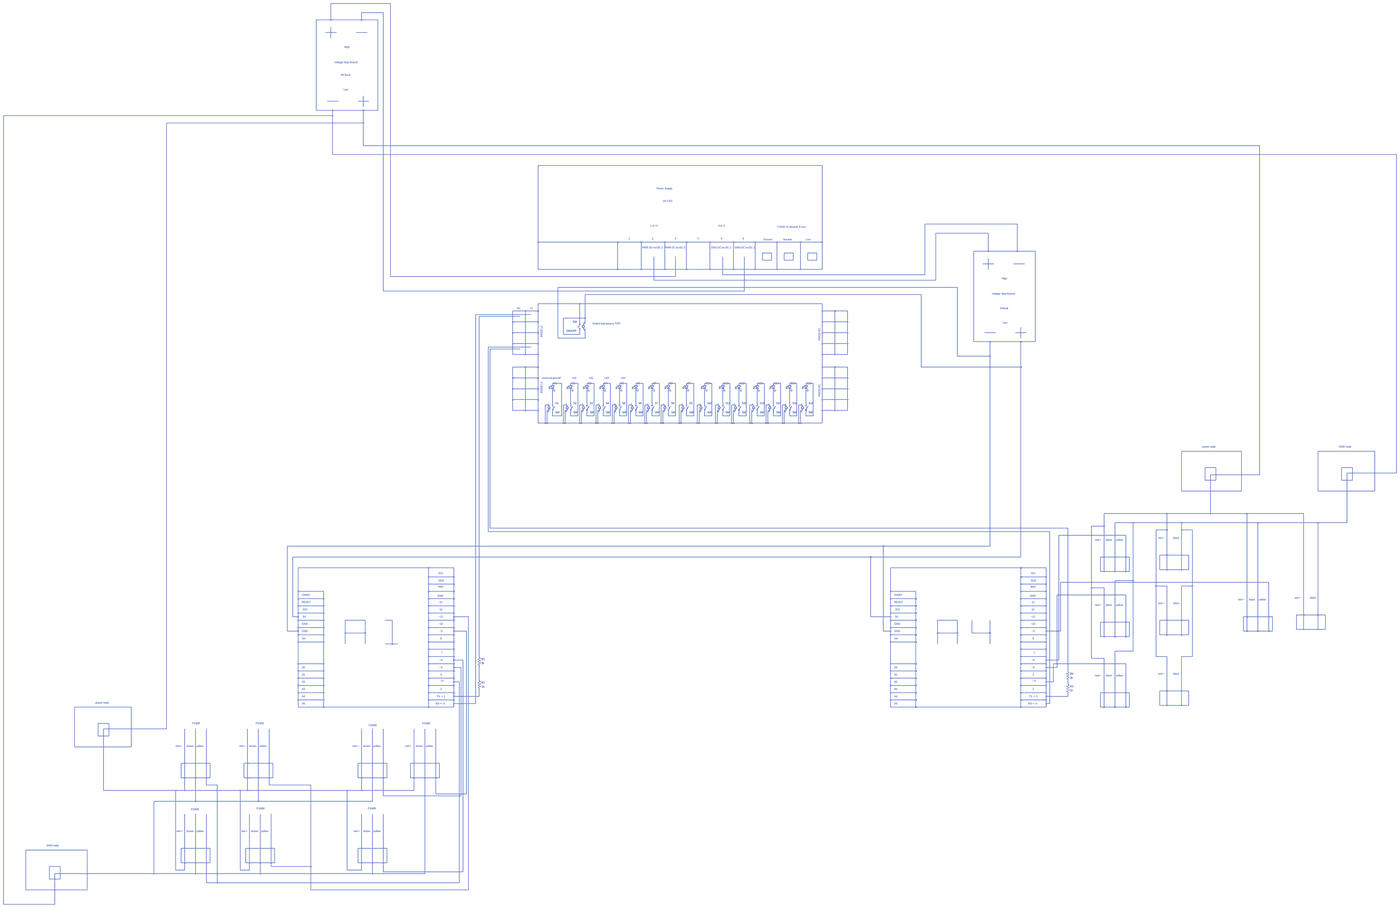
[diagram p0: schematic FDR Schematic.asc, whole sheet]
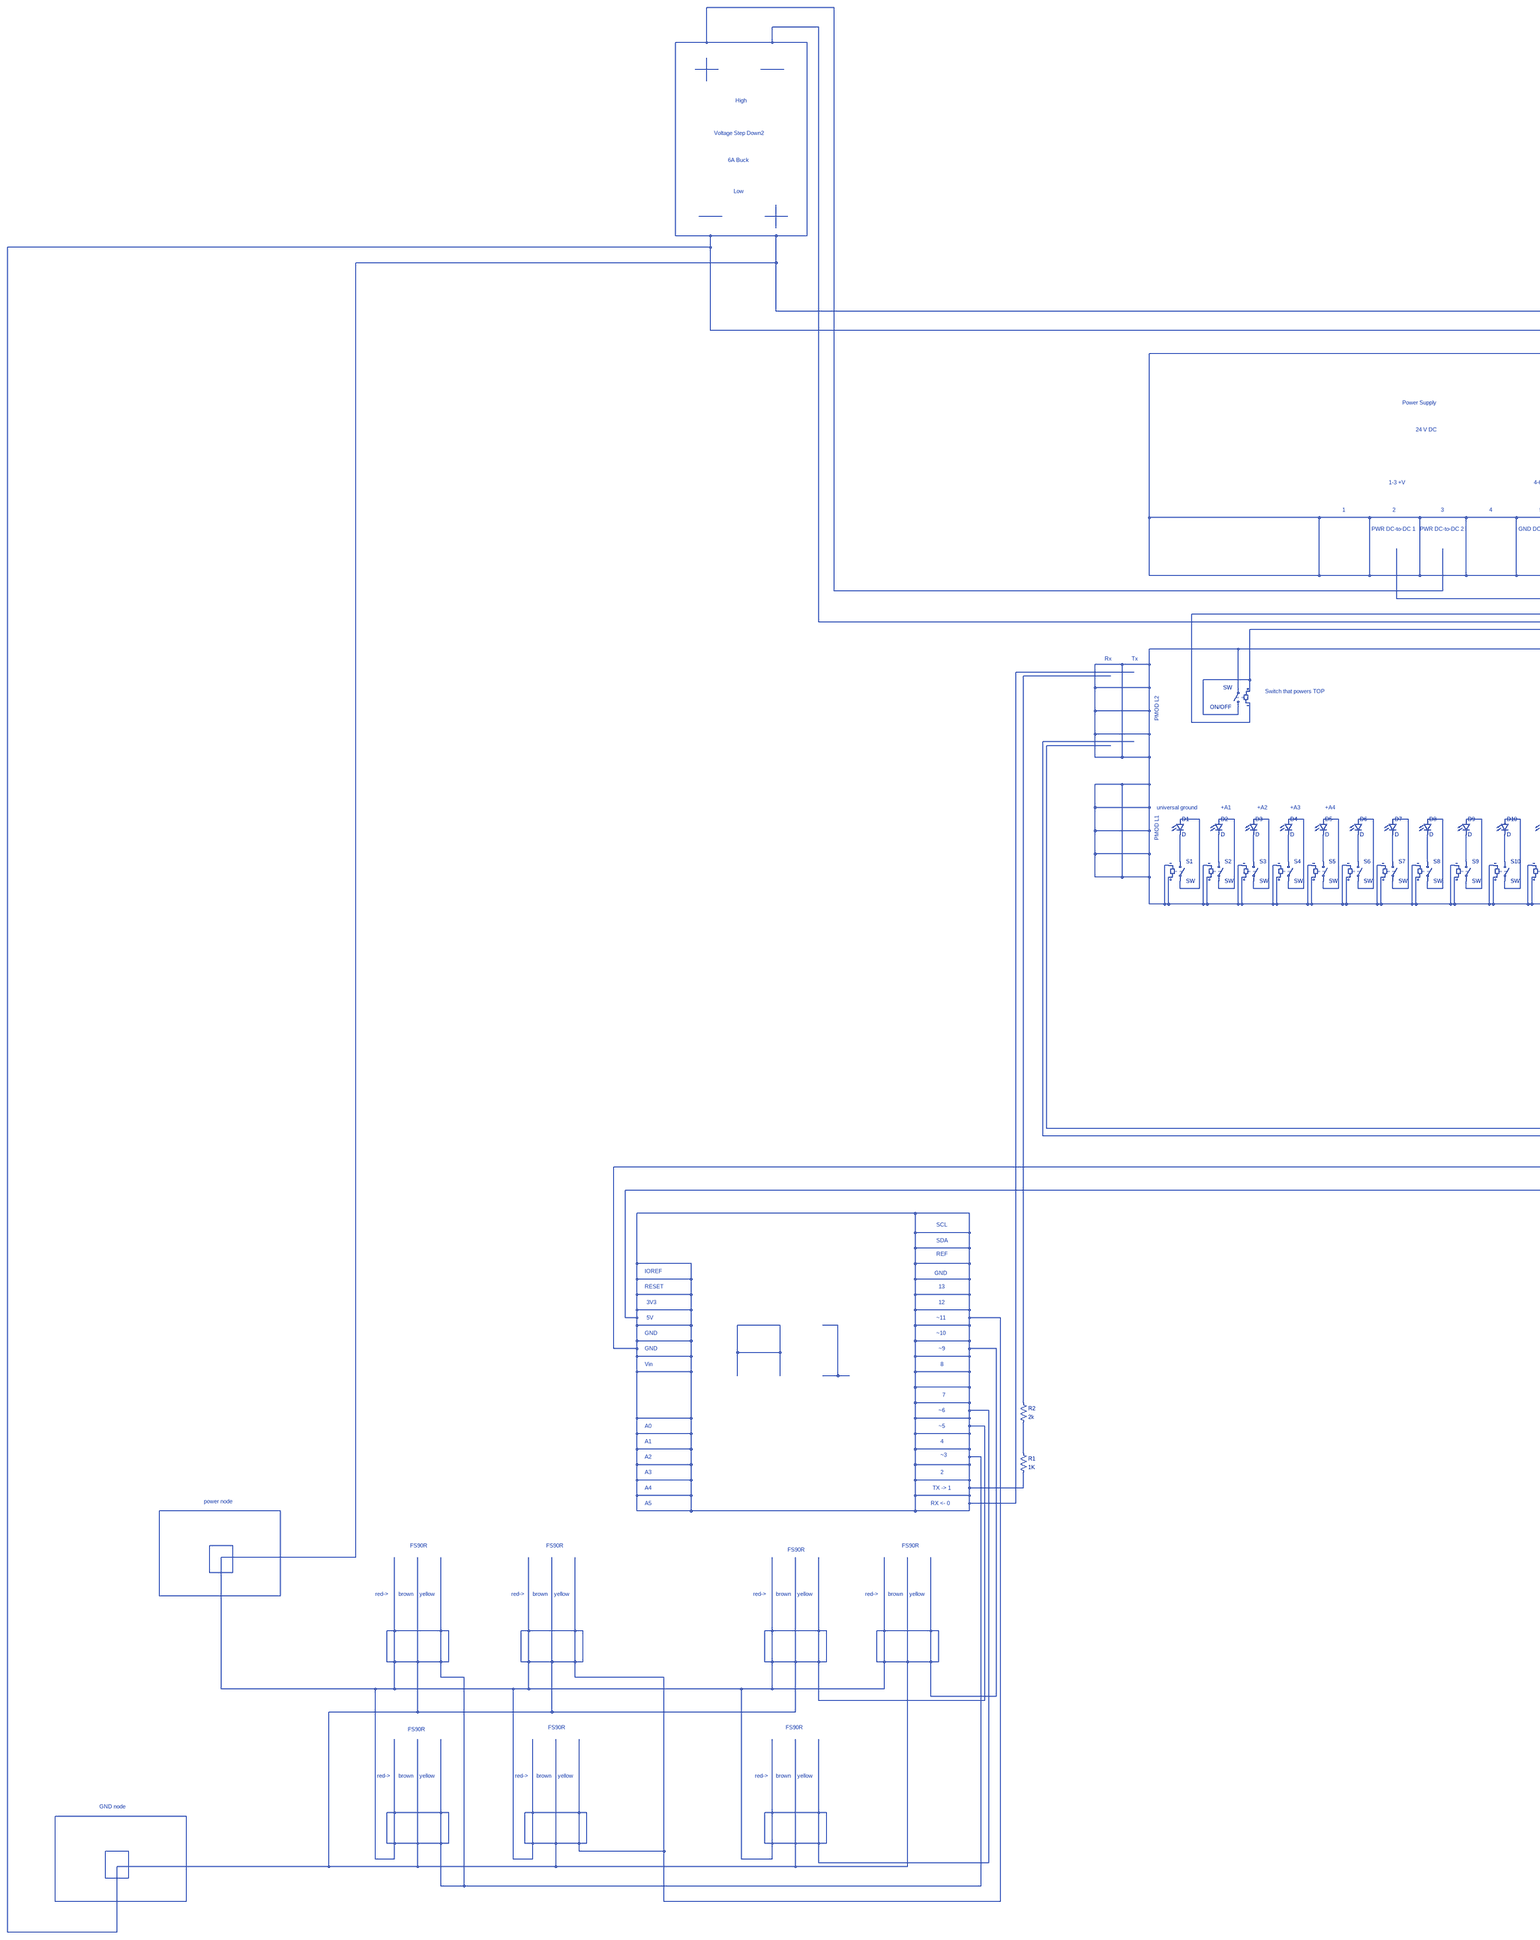
[diagram p1: schematic FDR Schematic.asc, part, row 1 of 1, column 1 of 2]
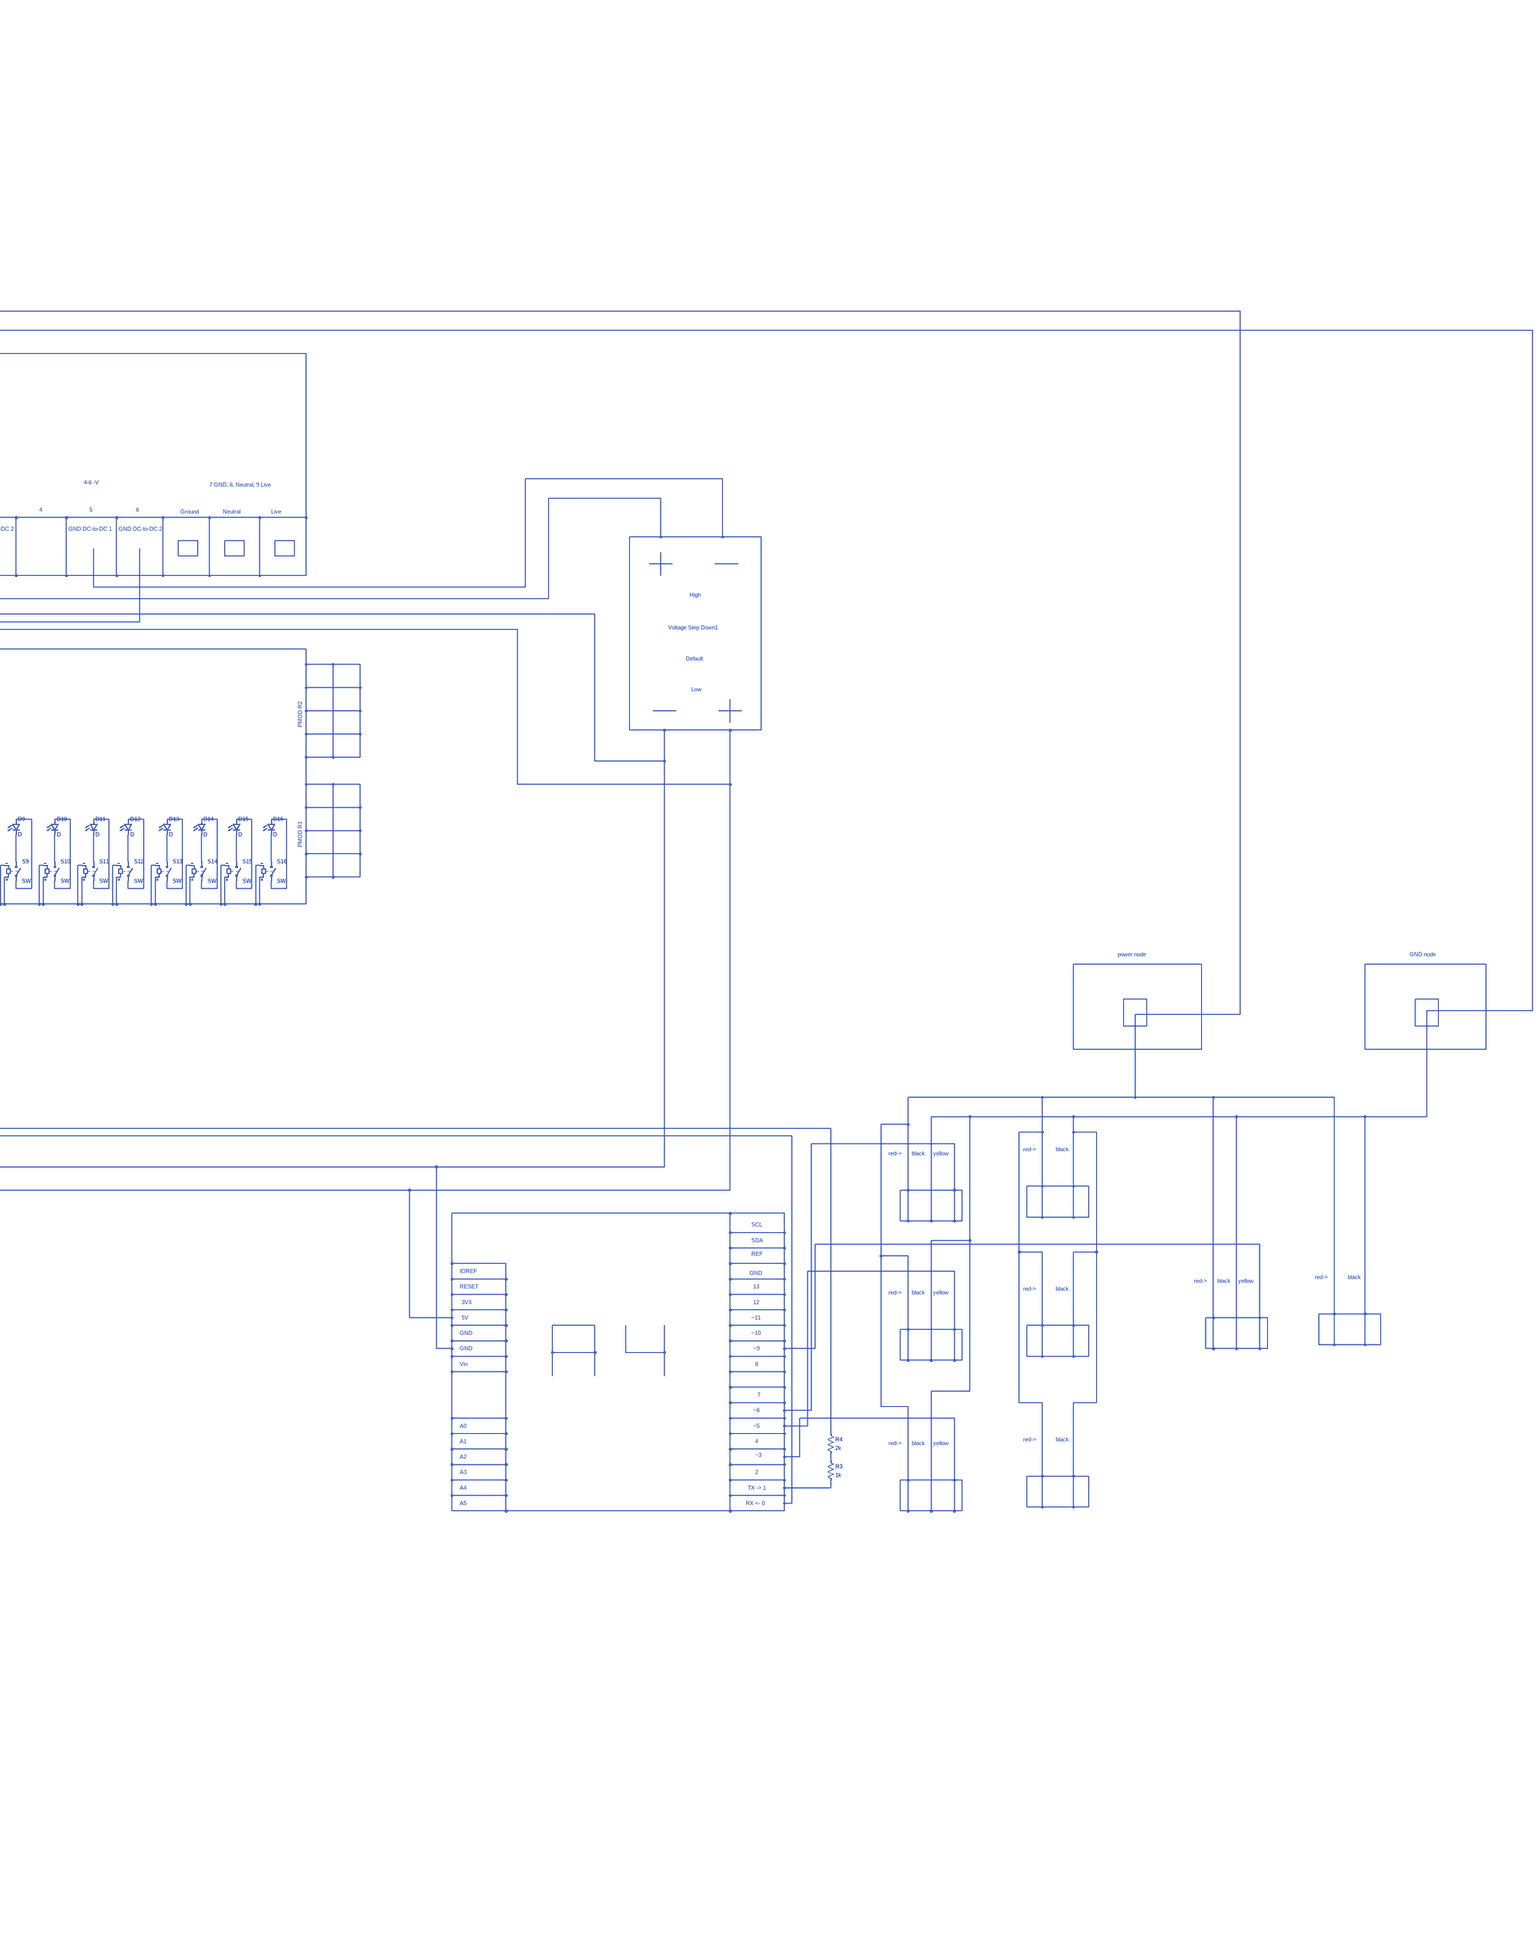
[diagram p2: schematic FDR Schematic.asc, part, row 1 of 1, column 2 of 2]
FDR Schematic.asc, the LTspice schematic file:
Version 4
SHEET 1 10276 11364
WIRE -1760 -7360 -2288 -7360
WIRE -1824 -7280 -2016 -7280
WIRE -2288 -7216 -2288 -7360
WIRE -2288 -7216 -2416 -7216
WIRE -2016 -7216 -2016 -7280
WIRE -2016 -7216 -2288 -7216
WIRE -1872 -7216 -2016 -7216
WIRE -2240 -7104 -2336 -7104
WIRE -1968 -7104 -2064 -7104
WIRE -2288 -7056 -2288 -7152
WIRE -2224 -6496 -2320 -6496
WIRE -1952 -6496 -2048 -6496
WIRE -2000 -6448 -2000 -6544
WIRE -2416 -6416 -2416 -7216
WIRE -2272 -6416 -2416 -6416
WIRE -2000 -6416 -2272 -6416
WIRE -1872 -6416 -1872 -7216
WIRE -1872 -6416 -2000 -6416
WIRE -2272 -6368 -2272 -6416
WIRE -2272 -6368 -5504 -6368
WIRE -2000 -6304 -2000 -6416
WIRE -2000 -6304 -3808 -6304
WIRE -2000 -5648 -2000 -6304
WIRE 6976 -5648 -2000 -5648
WIRE -2272 -5568 -2272 -6368
WIRE 8368 -5568 -2272 -5568
WIRE 2528 -5472 16 -5472
WIRE 4736 -4640 3920 -4640
WIRE 4480 -4560 4016 -4560
WIRE 16 -4480 16 -5472
WIRE 720 -4480 16 -4480
WIRE 928 -4480 720 -4480
WIRE 1136 -4480 928 -4480
WIRE 1328 -4480 1136 -4480
WIRE 1536 -4480 1328 -4480
WIRE 1744 -4480 1536 -4480
WIRE 1936 -4480 1744 -4480
WIRE 2128 -4480 1936 -4480
WIRE 2336 -4480 2128 -4480
WIRE 2528 -4480 2528 -5472
WIRE 2528 -4480 2336 -4480
WIRE 4480 -4400 4480 -4560
WIRE 4480 -4400 4352 -4400
WIRE 4736 -4400 4736 -4640
WIRE 4736 -4400 4480 -4400
WIRE 4896 -4400 4736 -4400
WIRE 2080 -4384 2000 -4384
WIRE 2272 -4384 2192 -4384
WIRE 2480 -4384 2400 -4384
WIRE 2000 -4320 2000 -4384
WIRE 2080 -4320 2080 -4384
WIRE 2080 -4320 2000 -4320
WIRE 2192 -4320 2192 -4384
WIRE 2272 -4320 2272 -4384
WIRE 2272 -4320 2192 -4320
WIRE 2400 -4320 2400 -4384
WIRE 2480 -4320 2480 -4384
WIRE 2480 -4320 2400 -4320
WIRE 4528 -4288 4432 -4288
WIRE 4800 -4288 4704 -4288
WIRE 16 -4240 16 -4480
WIRE 720 -4240 720 -4480
WIRE 720 -4240 16 -4240
WIRE 928 -4240 928 -4480
WIRE 928 -4240 720 -4240
WIRE 1136 -4240 1136 -4480
WIRE 1136 -4240 928 -4240
WIRE 1328 -4240 1328 -4480
WIRE 1328 -4240 1136 -4240
WIRE 1536 -4240 1536 -4480
WIRE 1536 -4240 1328 -4240
WIRE 1744 -4240 1744 -4480
WIRE 1744 -4240 1536 -4240
WIRE 1936 -4240 1936 -4480
WIRE 1936 -4240 1744 -4240
WIRE 2128 -4240 2128 -4480
WIRE 2128 -4240 1936 -4240
WIRE 2336 -4240 2336 -4480
WIRE 2336 -4240 2128 -4240
WIRE 2528 -4240 2528 -4480
WIRE 2528 -4240 2336 -4240
WIRE 4480 -4240 4480 -4336
WIRE 1648 -4192 1648 -4352
WIRE 3920 -4192 3920 -4640
WIRE 3920 -4192 1648 -4192
WIRE -1760 -4176 -1760 -7360
WIRE 1232 -4176 1232 -4352
WIRE 1232 -4176 -1760 -4176
WIRE 1040 -4144 1040 -4352
WIRE 4016 -4144 4016 -4560
WIRE 4016 -4144 1040 -4144
WIRE 4208 -4080 192 -4080
WIRE -1824 -4048 -1824 -7280
WIRE 1840 -4048 1840 -4352
WIRE 1840 -4048 -1824 -4048
WIRE 3888 -4016 432 -4016
WIRE 384 -3936 16 -3936
WIRE 2528 -3936 384 -3936
WIRE -96 -3872 -208 -3872
WIRE 16 -3872 16 -3936
WIRE 16 -3872 -96 -3872
WIRE 2528 -3872 2528 -3936
WIRE 2640 -3872 2528 -3872
WIRE 2752 -3872 2640 -3872
WIRE -48 -3840 -1008 -3840
WIRE -144 -3824 -976 -3824
WIRE 432 -3808 432 -4016
WIRE 432 -3808 240 -3808
WIRE -208 -3776 -208 -3872
WIRE 16 -3776 16 -3872
WIRE 16 -3776 -208 -3776
WIRE 384 -3776 384 -3936
WIRE 2528 -3776 2528 -3872
WIRE 2752 -3776 2752 -3872
WIRE 2752 -3776 2528 -3776
WIRE 432 -3760 432 -3808
WIRE -208 -3680 -208 -3776
WIRE 16 -3680 16 -3776
WIRE 16 -3680 -208 -3680
WIRE 2528 -3680 2528 -3776
WIRE 2752 -3680 2752 -3776
WIRE 2752 -3680 2528 -3680
WIRE 4544 -3680 4448 -3680
WIRE 4816 -3680 4720 -3680
WIRE 240 -3664 240 -3808
WIRE 384 -3664 384 -3696
WIRE 384 -3664 240 -3664
WIRE 192 -3632 192 -4080
WIRE 432 -3632 432 -3712
WIRE 432 -3632 192 -3632
WIRE 4768 -3632 4768 -3728
WIRE 4352 -3600 4352 -4400
WIRE 4496 -3600 4352 -3600
WIRE 4768 -3600 4496 -3600
WIRE 4896 -3600 4896 -4400
WIRE 4896 -3600 4768 -3600
WIRE -208 -3584 -208 -3680
WIRE 16 -3584 16 -3680
WIRE 16 -3584 -208 -3584
WIRE 2528 -3584 2528 -3680
WIRE 2752 -3584 2752 -3680
WIRE 2752 -3584 2528 -3584
WIRE -48 -3552 -896 -3552
WIRE -144 -3536 -880 -3536
WIRE -208 -3488 -208 -3584
WIRE -96 -3488 -96 -3872
WIRE -96 -3488 -208 -3488
WIRE 16 -3488 16 -3584
WIRE 16 -3488 -96 -3488
WIRE 2528 -3488 2528 -3584
WIRE 2640 -3488 2640 -3872
WIRE 2640 -3488 2528 -3488
WIRE 2752 -3488 2752 -3584
WIRE 2752 -3488 2640 -3488
WIRE 4208 -3472 4208 -4080
WIRE 4496 -3472 4496 -3600
WIRE 4496 -3472 4208 -3472
WIRE -96 -3376 -208 -3376
WIRE 16 -3376 16 -3488
WIRE 16 -3376 -96 -3376
WIRE 2528 -3376 2528 -3488
WIRE 2640 -3376 2528 -3376
WIRE 2752 -3376 2640 -3376
WIRE 3888 -3376 3888 -4016
WIRE 4768 -3376 4768 -3600
WIRE 4768 -3376 3888 -3376
WIRE -208 -3280 -208 -3376
WIRE 16 -3280 16 -3376
WIRE 16 -3280 -208 -3280
WIRE 2528 -3280 2528 -3376
WIRE 2752 -3280 2752 -3376
WIRE 2752 -3280 2528 -3280
WIRE 224 -3232 144 -3232
WIRE 368 -3232 304 -3232
WIRE 512 -3232 448 -3232
WIRE 656 -3232 592 -3232
WIRE 800 -3232 736 -3232
WIRE 944 -3232 880 -3232
WIRE 1088 -3232 1024 -3232
WIRE 1232 -3232 1168 -3232
WIRE 1392 -3232 1328 -3232
WIRE 1552 -3232 1488 -3232
WIRE 1712 -3232 1648 -3232
WIRE 1856 -3232 1792 -3232
WIRE 2016 -3232 1952 -3232
WIRE 2160 -3232 2096 -3232
WIRE 2304 -3232 2240 -3232
WIRE 2448 -3232 2384 -3232
WIRE -208 -3184 -208 -3280
WIRE 16 -3184 16 -3280
WIRE 16 -3184 -208 -3184
WIRE 2528 -3184 2528 -3280
WIRE 2752 -3184 2752 -3280
WIRE 2752 -3184 2528 -3184
WIRE -208 -3088 -208 -3184
WIRE 16 -3088 16 -3184
WIRE 16 -3088 -208 -3088
WIRE 2528 -3088 2528 -3184
WIRE 2752 -3088 2752 -3184
WIRE 2752 -3088 2528 -3088
WIRE 144 -3056 144 -3168
WIRE 304 -3056 304 -3168
WIRE 448 -3056 448 -3168
WIRE 592 -3056 592 -3168
WIRE 736 -3056 736 -3168
WIRE 880 -3056 880 -3168
WIRE 1024 -3056 1024 -3168
WIRE 1168 -3056 1168 -3168
WIRE 1328 -3056 1328 -3168
WIRE 1488 -3056 1488 -3168
WIRE 1648 -3056 1648 -3168
WIRE 1792 -3056 1792 -3168
WIRE 1952 -3056 1952 -3168
WIRE 2096 -3056 2096 -3168
WIRE 2240 -3056 2240 -3168
WIRE 2384 -3056 2384 -3168
WIRE 96 -3040 80 -3040
WIRE 256 -3040 240 -3040
WIRE 400 -3040 384 -3040
WIRE 544 -3040 528 -3040
WIRE 688 -3040 672 -3040
WIRE 832 -3040 816 -3040
WIRE 976 -3040 960 -3040
WIRE 1120 -3040 1104 -3040
WIRE 1280 -3040 1264 -3040
WIRE 1440 -3040 1424 -3040
WIRE 1600 -3040 1584 -3040
WIRE 1744 -3040 1728 -3040
WIRE 1904 -3040 1888 -3040
WIRE 2048 -3040 2032 -3040
WIRE 2192 -3040 2176 -3040
WIRE 2336 -3040 2320 -3040
WIRE -208 -2992 -208 -3088
WIRE -96 -2992 -96 -3376
WIRE -96 -2992 -208 -2992
WIRE 16 -2992 16 -3088
WIRE 16 -2992 -96 -2992
WIRE 2528 -2992 2528 -3088
WIRE 2640 -2992 2640 -3376
WIRE 2640 -2992 2528 -2992
WIRE 2752 -2992 2752 -3088
WIRE 2752 -2992 2640 -2992
WIRE 144 -2944 144 -2976
WIRE 224 -2944 224 -3232
WIRE 224 -2944 144 -2944
WIRE 304 -2944 304 -2976
WIRE 368 -2944 368 -3232
WIRE 368 -2944 304 -2944
WIRE 448 -2944 448 -2976
WIRE 512 -2944 512 -3232
WIRE 512 -2944 448 -2944
WIRE 592 -2944 592 -2976
WIRE 656 -2944 656 -3232
WIRE 656 -2944 592 -2944
WIRE 736 -2944 736 -2976
WIRE 800 -2944 800 -3232
WIRE 800 -2944 736 -2944
WIRE 880 -2944 880 -2976
WIRE 944 -2944 944 -3232
WIRE 944 -2944 880 -2944
WIRE 1024 -2944 1024 -2976
WIRE 1088 -2944 1088 -3232
WIRE 1088 -2944 1024 -2944
WIRE 1168 -2944 1168 -2976
WIRE 1232 -2944 1232 -3232
WIRE 1232 -2944 1168 -2944
WIRE 1328 -2944 1328 -2976
WIRE 1392 -2944 1392 -3232
WIRE 1392 -2944 1328 -2944
WIRE 1488 -2944 1488 -2976
WIRE 1552 -2944 1552 -3232
WIRE 1552 -2944 1488 -2944
WIRE 1648 -2944 1648 -2976
WIRE 1712 -2944 1712 -3232
WIRE 1712 -2944 1648 -2944
WIRE 1792 -2944 1792 -2976
WIRE 1856 -2944 1856 -3232
WIRE 1856 -2944 1792 -2944
WIRE 1952 -2944 1952 -2976
WIRE 2016 -2944 2016 -3232
WIRE 2016 -2944 1952 -2944
WIRE 2096 -2944 2096 -2976
WIRE 2160 -2944 2160 -3232
WIRE 2160 -2944 2096 -2944
WIRE 2240 -2944 2240 -2976
WIRE 2304 -2944 2304 -3232
WIRE 2304 -2944 2240 -2944
WIRE 2384 -2944 2384 -2976
WIRE 2448 -2944 2448 -3232
WIRE 2448 -2944 2384 -2944
WIRE 16 -2880 16 -2992
WIRE 80 -2880 80 -3040
WIRE 80 -2880 16 -2880
WIRE 96 -2880 96 -2992
WIRE 96 -2880 80 -2880
WIRE 240 -2880 240 -3040
WIRE 240 -2880 96 -2880
WIRE 256 -2880 256 -2992
WIRE 256 -2880 240 -2880
WIRE 384 -2880 384 -3040
WIRE 384 -2880 256 -2880
WIRE 400 -2880 400 -2992
WIRE 400 -2880 384 -2880
WIRE 528 -2880 528 -3040
WIRE 528 -2880 400 -2880
WIRE 544 -2880 544 -2992
WIRE 544 -2880 528 -2880
WIRE 672 -2880 672 -3040
WIRE 672 -2880 544 -2880
WIRE 688 -2880 688 -2992
WIRE 688 -2880 672 -2880
WIRE 816 -2880 816 -3040
WIRE 816 -2880 688 -2880
WIRE 832 -2880 832 -2992
WIRE 832 -2880 816 -2880
WIRE 960 -2880 960 -3040
WIRE 960 -2880 832 -2880
WIRE 976 -2880 976 -2992
WIRE 976 -2880 960 -2880
WIRE 1104 -2880 1104 -3040
WIRE 1104 -2880 976 -2880
WIRE 1120 -2880 1120 -2992
WIRE 1120 -2880 1104 -2880
WIRE 1264 -2880 1264 -3040
WIRE 1264 -2880 1120 -2880
WIRE 1280 -2880 1280 -2992
WIRE 1280 -2880 1264 -2880
WIRE 1424 -2880 1424 -3040
WIRE 1424 -2880 1280 -2880
WIRE 1440 -2880 1440 -2992
WIRE 1440 -2880 1424 -2880
WIRE 1584 -2880 1584 -3040
WIRE 1584 -2880 1440 -2880
WIRE 1600 -2880 1600 -2992
WIRE 1600 -2880 1584 -2880
WIRE 1728 -2880 1728 -3040
WIRE 1728 -2880 1600 -2880
WIRE 1744 -2880 1744 -2992
WIRE 1744 -2880 1728 -2880
WIRE 1888 -2880 1888 -3040
WIRE 1888 -2880 1744 -2880
WIRE 1904 -2880 1904 -2992
WIRE 1904 -2880 1888 -2880
WIRE 2032 -2880 2032 -3040
WIRE 2032 -2880 1904 -2880
WIRE 2048 -2880 2048 -2992
WIRE 2048 -2880 2032 -2880
WIRE 2176 -2880 2176 -3040
WIRE 2176 -2880 2048 -2880
WIRE 2192 -2880 2192 -2992
WIRE 2192 -2880 2176 -2880
WIRE 2320 -2880 2320 -3040
WIRE 2320 -2880 2192 -2880
WIRE 2336 -2880 2336 -2992
WIRE 2336 -2880 2320 -2880
WIRE 2528 -2880 2528 -2992
WIRE 2528 -2880 2336 -2880
WIRE 6816 -608 6272 -608
WIRE 8176 -608 7632 -608
WIRE 6576 -464 6480 -464
WIRE 7936 -464 7840 -464
WIRE 8368 -416 8368 -5568
WIRE 8368 -416 7888 -416
WIRE 6976 -400 6976 -5648
WIRE 6976 -400 6528 -400
WIRE 6480 -352 6480 -464
WIRE 6576 -352 6576 -464
WIRE 6576 -352 6480 -352
WIRE 7840 -352 7840 -464
WIRE 7936 -352 7936 -464
WIRE 7936 -352 7840 -352
WIRE 6272 -256 6272 -608
WIRE 6816 -256 6816 -608
WIRE 6816 -256 6272 -256
WIRE 7632 -256 7632 -608
WIRE 8176 -256 8176 -608
WIRE 8176 -256 7632 -256
WIRE 6144 176 5504 176
WIRE 6528 176 6528 -400
WIRE 6528 176 6144 176
WIRE 6864 176 6528 176
WIRE 7504 176 6864 176
WIRE 5760 256 5600 256
WIRE 6272 256 5760 256
WIRE 6960 256 6272 256
WIRE 7632 256 6960 256
WIRE 7888 256 7888 -416
WIRE 7888 256 7632 256
WIRE 5504 288 5504 176
WIRE 5504 288 5392 288
WIRE -880 304 -880 -3536
WIRE 5184 304 -880 304
WIRE 6144 320 6144 176
WIRE 6144 320 6048 320
WIRE 6272 320 6272 256
WIRE 6368 320 6272 320
WIRE -896 336 -896 -3552
WIRE 5024 336 -896 336
WIRE 5696 368 5104 368
WIRE 3552 464 -2672 464
WIRE 4496 464 4496 -3472
WIRE 4496 464 3552 464
WIRE 6144 544 6144 320
WIRE 6144 544 6080 544
WIRE 6272 544 6272 320
WIRE 6272 544 6144 544
WIRE 6336 544 6272 544
WIRE 3440 560 -2624 560
WIRE 4768 560 4768 -3376
WIRE 4768 560 3440 560
WIRE 5504 560 5504 288
WIRE 5504 560 5472 560
WIRE 5696 560 5696 368
WIRE 5696 560 5504 560
WIRE 5728 560 5696 560
WIRE -1424 656 -2576 656
WIRE -1200 656 -1424 656
WIRE 4768 656 3616 656
WIRE 4992 656 4768 656
WIRE 6080 672 6080 544
WIRE 6144 672 6144 544
WIRE 6144 672 6080 672
WIRE 6272 672 6272 544
WIRE 6272 672 6144 672
WIRE 6336 672 6336 544
WIRE 6336 672 6272 672
WIRE 5472 688 5472 560
WIRE 5504 688 5504 560
WIRE 5504 688 5472 688
WIRE 5600 688 5600 256
WIRE 5600 688 5504 688
WIRE 5696 688 5696 560
WIRE 5696 688 5600 688
WIRE 5728 688 5728 560
WIRE 5728 688 5696 688
WIRE -1424 736 -1424 656
WIRE -1200 736 -1200 656
WIRE -1200 736 -1424 736
WIRE 4768 736 4768 656
WIRE 4992 736 4992 656
WIRE 4992 736 4768 736
WIRE 5760 768 5760 256
WIRE 5760 768 5600 768
WIRE 7056 784 5120 784
WIRE -1424 800 -1424 736
WIRE -1200 800 -1200 736
WIRE -1200 800 -1424 800
WIRE 4768 800 4768 736
WIRE 4992 800 4992 736
WIRE 4992 800 4768 800
WIRE 6048 816 6048 320
WIRE 6144 816 6048 816
WIRE 6368 816 6368 320
WIRE 6368 816 6272 816
WIRE 5392 832 5392 288
WIRE 5504 832 5392 832
WIRE -2576 864 -2576 656
WIRE -2352 864 -2576 864
WIRE -1424 864 -1424 800
WIRE -1200 864 -1200 800
WIRE -1200 864 -1424 864
WIRE 3616 864 3616 656
WIRE 3840 864 3616 864
WIRE 4768 864 4768 800
WIRE 4992 864 4992 800
WIRE 4992 864 4768 864
WIRE 5696 896 5088 896
WIRE -2576 928 -2576 864
WIRE -2352 928 -2352 864
WIRE -2352 928 -2576 928
WIRE -1424 928 -1424 864
WIRE -1200 928 -1200 864
WIRE -1200 928 -1424 928
WIRE 3616 928 3616 864
WIRE 3840 928 3840 864
WIRE 3840 928 3616 928
WIRE 4768 928 4768 864
WIRE 4992 928 4992 864
WIRE 4992 928 4768 928
WIRE -2576 992 -2576 928
WIRE -2352 992 -2352 928
WIRE -2352 992 -2576 992
WIRE -1424 992 -1424 928
WIRE -1200 992 -1200 928
WIRE -1200 992 -1424 992
WIRE 3616 992 3616 928
WIRE 3840 992 3840 928
WIRE 3840 992 3616 992
WIRE 4768 992 4768 928
WIRE 4992 992 4992 928
WIRE 4992 992 4768 992
WIRE -2576 1056 -2576 992
WIRE -2352 1056 -2352 992
WIRE -2352 1056 -2576 1056
WIRE -1424 1056 -1424 992
WIRE -1200 1056 -1200 992
WIRE -1200 1056 -1424 1056
WIRE 3616 1056 3616 992
WIRE 3840 1056 3840 992
WIRE 3840 1056 3616 1056
WIRE 4768 1056 4768 992
WIRE 4992 1056 4992 992
WIRE 4992 1056 4768 1056
WIRE 7504 1072 7504 176
WIRE 7504 1072 7440 1072
WIRE 7632 1072 7632 256
WIRE 7632 1072 7504 1072
WIRE 7696 1072 7632 1072
WIRE -2624 1088 -2624 560
WIRE -2576 1088 -2576 1056
WIRE -2576 1088 -2624 1088
WIRE -1200 1088 -1200 1056
WIRE -1072 1088 -1200 1088
WIRE 3440 1088 3440 560
WIRE 3616 1088 3616 1056
WIRE 3616 1088 3440 1088
WIRE 6864 1088 6864 176
WIRE 6864 1088 6832 1088
WIRE 7056 1088 7056 784
WIRE 7056 1088 6864 1088
WIRE 7088 1088 7056 1088
WIRE -2576 1120 -2576 1088
WIRE -2352 1120 -2352 1056
WIRE -2352 1120 -2576 1120
WIRE -1984 1120 -2160 1120
WIRE -1744 1120 -1808 1120
WIRE -1424 1120 -1424 1056
WIRE -1200 1120 -1200 1088
WIRE -1200 1120 -1424 1120
WIRE 3616 1120 3616 1088
WIRE 3840 1120 3840 1056
WIRE 3840 1120 3616 1120
WIRE 4208 1120 4032 1120
WIRE 4768 1120 4768 1056
WIRE 4992 1120 4992 1056
WIRE 4992 1120 4768 1120
WIRE 6144 1120 6144 816
WIRE 6144 1120 6080 1120
WIRE 6272 1120 6272 816
WIRE 6272 1120 6144 1120
WIRE 6336 1120 6272 1120
WIRE 5504 1136 5504 832
WIRE 5504 1136 5472 1136
WIRE 5696 1136 5696 896
WIRE 5696 1136 5504 1136
WIRE 5728 1136 5696 1136
WIRE -2576 1184 -2576 1120
WIRE -2352 1184 -2352 1120
WIRE -2352 1184 -2576 1184
WIRE -1424 1184 -1424 1120
WIRE -1200 1184 -1200 1120
WIRE -1200 1184 -1424 1184
WIRE 3616 1184 3616 1120
WIRE 3840 1184 3840 1120
WIRE 3840 1184 3616 1184
WIRE 4768 1184 4768 1120
WIRE 4992 1184 4992 1120
WIRE 4992 1184 4768 1184
WIRE 7440 1200 7440 1072
WIRE 7504 1200 7504 1072
WIRE 7504 1200 7440 1200
WIRE 7632 1200 7632 1072
WIRE 7632 1200 7504 1200
WIRE 7696 1200 7696 1072
WIRE 7696 1200 7632 1200
WIRE -2672 1216 -2672 464
WIRE -2576 1216 -2576 1184
WIRE -2576 1216 -2672 1216
WIRE -1200 1216 -1200 1184
WIRE -1088 1216 -1200 1216
WIRE 3552 1216 3552 464
WIRE 3616 1216 3616 1184
WIRE 3616 1216 3552 1216
WIRE 4992 1216 4992 1184
WIRE 5120 1216 5120 784
WIRE 5120 1216 4992 1216
WIRE 6832 1216 6832 1088
WIRE 6864 1216 6864 1088
WIRE 6864 1216 6832 1216
WIRE 6960 1216 6960 256
WIRE 6960 1216 6864 1216
WIRE 7056 1216 7056 1088
WIRE 7056 1216 6960 1216
WIRE 7088 1216 7088 1088
WIRE 7088 1216 7056 1216
WIRE -2160 1232 -2160 1120
WIRE -1984 1232 -1984 1120
WIRE -1984 1232 -2160 1232
WIRE 4032 1232 4032 1120
WIRE 4208 1232 4208 1120
WIRE 4208 1232 4032 1232
WIRE 4336 1232 4336 1120
WIRE 4496 1232 4496 1120
WIRE 4496 1232 4336 1232
WIRE -2576 1248 -2576 1216
WIRE -2352 1248 -2352 1184
WIRE -2352 1248 -2576 1248
WIRE -1424 1248 -1424 1184
WIRE -1200 1248 -1200 1216
WIRE -1200 1248 -1424 1248
WIRE 3616 1248 3616 1216
WIRE 3840 1248 3840 1184
WIRE 3840 1248 3616 1248
WIRE 4768 1248 4768 1184
WIRE 4992 1248 4992 1216
WIRE 4992 1248 4768 1248
WIRE 6080 1248 6080 1120
WIRE 6144 1248 6144 1120
WIRE 6144 1248 6080 1248
WIRE 6272 1248 6272 1120
WIRE 6272 1248 6144 1248
WIRE 6336 1248 6336 1120
WIRE 6336 1248 6272 1248
WIRE 5472 1264 5472 1136
WIRE 5504 1264 5504 1136
WIRE 5504 1264 5472 1264
WIRE 5600 1264 5600 768
WIRE 5600 1264 5504 1264
WIRE 5696 1264 5696 1136
WIRE 5696 1264 5600 1264
WIRE 5728 1264 5728 1136
WIRE 5728 1264 5696 1264
WIRE -2576 1312 -2576 1248
WIRE -2352 1312 -2352 1248
WIRE -2352 1312 -2576 1312
WIRE -1424 1312 -1424 1248
WIRE -1200 1312 -1200 1248
WIRE -1200 1312 -1424 1312
WIRE 3616 1312 3616 1248
WIRE 3840 1312 3840 1248
WIRE 3840 1312 3616 1312
WIRE 4768 1312 4768 1248
WIRE 4992 1312 4992 1248
WIRE 4992 1312 4768 1312
WIRE -2160 1328 -2160 1232
WIRE -1984 1328 -1984 1232
WIRE -1744 1328 -1744 1120
WIRE -1744 1328 -1808 1328
WIRE -1696 1328 -1744 1328
WIRE 4032 1328 4032 1232
WIRE 4208 1328 4208 1232
WIRE 4496 1328 4496 1232
WIRE -1424 1376 -1424 1312
WIRE -1200 1376 -1200 1312
WIRE -1200 1376 -1424 1376
WIRE 4768 1376 4768 1312
WIRE 4992 1376 4992 1312
WIRE 4992 1376 4768 1376
WIRE 5760 1392 5760 768
WIRE 5760 1392 5600 1392
WIRE -1424 1440 -1424 1376
WIRE -1200 1440 -1200 1376
WIRE -1200 1440 -1424 1440
WIRE -976 1440 -976 -3824
WIRE 4768 1440 4768 1376
WIRE 4992 1440 4992 1376
WIRE 4992 1440 4768 1440
WIRE 6048 1440 6048 816
WIRE 6144 1440 6048 1440
WIRE 6368 1440 6368 816
WIRE 6368 1440 6272 1440
WIRE 5392 1456 5392 832
WIRE 5504 1456 5392 1456
WIRE -1200 1472 -1200 1440
WIRE -1120 1472 -1200 1472
WIRE 4992 1472 4992 1440
WIRE 5104 1472 5104 368
WIRE 5104 1472 4992 1472
WIRE -2576 1504 -2576 1312
WIRE -2352 1504 -2352 1312
WIRE -2352 1504 -2576 1504
WIRE -1424 1504 -1424 1440
WIRE -1200 1504 -1200 1472
WIRE -1200 1504 -1424 1504
WIRE 3616 1504 3616 1312
WIRE 3840 1504 3840 1312
WIRE 3840 1504 3616 1504
WIRE 4768 1504 4768 1440
WIRE 4992 1504 4992 1472
WIRE 4992 1504 4768 1504
WIRE 5696 1504 5056 1504
WIRE -1200 1536 -1200 1504
WIRE -1136 1536 -1200 1536
WIRE 4992 1536 4992 1504
WIRE 5088 1536 5088 896
WIRE 5088 1536 4992 1536
WIRE -2576 1568 -2576 1504
WIRE -2352 1568 -2352 1504
WIRE -2352 1568 -2576 1568
WIRE -1424 1568 -1424 1504
WIRE -1200 1568 -1200 1536
WIRE -1200 1568 -1424 1568
WIRE 3616 1568 3616 1504
WIRE 3840 1568 3840 1504
WIRE 3840 1568 3616 1568
WIRE 4768 1568 4768 1504
WIRE 4992 1568 4992 1536
WIRE 4992 1568 4768 1568
WIRE 5184 1568 5184 304
WIRE -2576 1632 -2576 1568
WIRE -2352 1632 -2352 1568
WIRE -2352 1632 -2576 1632
WIRE -1424 1632 -1424 1568
WIRE -1200 1632 -1200 1568
WIRE -1200 1632 -1424 1632
WIRE 3616 1632 3616 1568
WIRE 3840 1632 3840 1568
WIRE 3840 1632 3616 1632
WIRE 4768 1632 4768 1568
WIRE 4992 1632 4992 1568
WIRE 4992 1632 4768 1632
WIRE -976 1648 -976 1520
WIRE -1200 1664 -1200 1632
WIRE -1152 1664 -1200 1664
WIRE 4992 1664 4992 1632
WIRE 5056 1664 5056 1504
WIRE 5056 1664 4992 1664
WIRE 5184 1680 5184 1648
WIRE -2576 1696 -2576 1632
WIRE -2352 1696 -2352 1632
WIRE -2352 1696 -2576 1696
WIRE -1424 1696 -1424 1632
WIRE -1200 1696 -1200 1664
WIRE -1200 1696 -1424 1696
WIRE 3616 1696 3616 1632
WIRE 3840 1696 3840 1632
WIRE 3840 1696 3616 1696
WIRE 4768 1696 4768 1632
WIRE 4992 1696 4992 1664
WIRE 4992 1696 4768 1696
WIRE 6144 1744 6144 1440
WIRE 6144 1744 6080 1744
WIRE 6272 1744 6272 1440
WIRE 6272 1744 6144 1744
WIRE 6336 1744 6272 1744
WIRE -2576 1760 -2576 1696
WIRE -2352 1760 -2352 1696
WIRE -2352 1760 -2576 1760
WIRE -1424 1760 -1424 1696
WIRE -1200 1760 -1200 1696
WIRE -1200 1760 -1424 1760
WIRE 3616 1760 3616 1696
WIRE 3840 1760 3840 1696
WIRE 3840 1760 3616 1760
WIRE 4768 1760 4768 1696
WIRE 4992 1760 4992 1696
WIRE 4992 1760 4768 1760
WIRE 5504 1760 5504 1456
WIRE 5504 1760 5472 1760
WIRE 5696 1760 5696 1504
WIRE 5696 1760 5504 1760
WIRE 5728 1760 5696 1760
WIRE -1200 1792 -1200 1760
WIRE -976 1792 -976 1728
WIRE -976 1792 -1200 1792
WIRE 4992 1792 4992 1760
WIRE 5184 1792 5184 1760
WIRE 5184 1792 4992 1792
WIRE -2576 1824 -2576 1760
WIRE -2352 1824 -2352 1760
WIRE -2352 1824 -2576 1824
WIRE -1424 1824 -1424 1760
WIRE -1200 1824 -1200 1792
WIRE -1200 1824 -1424 1824
WIRE 3616 1824 3616 1760
WIRE 3840 1824 3840 1760
WIRE 3840 1824 3616 1824
WIRE 4768 1824 4768 1760
WIRE 4992 1824 4992 1792
WIRE 4992 1824 4768 1824
WIRE -1200 1856 -1200 1824
WIRE -1008 1856 -1008 -3840
WIRE -1008 1856 -1200 1856
WIRE 4992 1856 4992 1824
WIRE 5024 1856 5024 336
WIRE 5024 1856 4992 1856
WIRE 6080 1872 6080 1744
WIRE 6144 1872 6144 1744
WIRE 6144 1872 6080 1872
WIRE 6272 1872 6272 1744
WIRE 6272 1872 6144 1872
WIRE 6336 1872 6336 1744
WIRE 6336 1872 6272 1872
WIRE -4192 1888 -4736 1888
WIRE -2576 1888 -2576 1824
WIRE -2352 1888 -2352 1824
WIRE -2352 1888 -2576 1888
WIRE -1424 1888 -1424 1824
WIRE -1424 1888 -2352 1888
WIRE -1200 1888 -1200 1856
WIRE -1200 1888 -1424 1888
WIRE 3616 1888 3616 1824
WIRE 3840 1888 3840 1824
WIRE 3840 1888 3616 1888
WIRE 4768 1888 4768 1824
WIRE 4768 1888 3840 1888
WIRE 4992 1888 4992 1856
WIRE 4992 1888 4768 1888
WIRE 5472 1888 5472 1760
WIRE 5504 1888 5504 1760
WIRE 5504 1888 5472 1888
WIRE 5600 1888 5600 1392
WIRE 5600 1888 5504 1888
WIRE 5696 1888 5696 1760
WIRE 5696 1888 5600 1888
WIRE 5728 1888 5728 1760
WIRE 5728 1888 5696 1888
WIRE -4432 2032 -4528 2032
WIRE -3808 2080 -3808 -6304
WIRE -3808 2080 -4480 2080
WIRE -4528 2144 -4528 2032
WIRE -4432 2144 -4432 2032
WIRE -4432 2144 -4528 2144
WIRE -4736 2240 -4736 1888
WIRE -4192 2240 -4192 1888
WIRE -4192 2240 -4736 2240
WIRE -3648 2384 -3648 2080
WIRE -3648 2384 -3680 2384
WIRE -3456 2384 -3456 2080
WIRE -3456 2384 -3648 2384
WIRE -3424 2384 -3456 2384
WIRE -3024 2384 -3024 2080
WIRE -3024 2384 -3056 2384
WIRE -2832 2384 -2832 2080
WIRE -2832 2384 -3024 2384
WIRE -2800 2384 -2832 2384
WIRE -2016 2384 -2016 2080
WIRE -2016 2384 -2048 2384
WIRE -1824 2384 -1824 2080
WIRE -1824 2384 -2016 2384
WIRE -1792 2384 -1824 2384
WIRE -1552 2384 -1552 2080
WIRE -1552 2384 -1584 2384
WIRE -1360 2384 -1360 2080
WIRE -1360 2384 -1552 2384
WIRE -1328 2384 -1360 2384
WIRE -3680 2512 -3680 2384
WIRE -3648 2512 -3648 2384
WIRE -3648 2512 -3680 2512
WIRE -3552 2512 -3552 2080
WIRE -3552 2512 -3648 2512
WIRE -3456 2512 -3456 2384
WIRE -3456 2512 -3552 2512
WIRE -3424 2512 -3424 2384
WIRE -3424 2512 -3456 2512
WIRE -3056 2512 -3056 2384
WIRE -3024 2512 -3024 2384
WIRE -3024 2512 -3056 2512
WIRE -2928 2512 -2928 2080
WIRE -2928 2512 -3024 2512
WIRE -2832 2512 -2832 2384
WIRE -2832 2512 -2928 2512
WIRE -2800 2512 -2800 2384
WIRE -2800 2512 -2832 2512
WIRE -2048 2512 -2048 2384
WIRE -2016 2512 -2016 2384
WIRE -2016 2512 -2048 2512
WIRE -1920 2512 -1920 2080
WIRE -1920 2512 -2016 2512
WIRE -1824 2512 -1824 2384
WIRE -1824 2512 -1920 2512
WIRE -1792 2512 -1792 2384
WIRE -1792 2512 -1824 2512
WIRE -1584 2512 -1584 2384
WIRE -1552 2512 -1552 2384
WIRE -1552 2512 -1584 2512
WIRE -1456 2512 -1456 2080
WIRE -1456 2512 -1552 2512
WIRE -1360 2512 -1360 2384
WIRE -1360 2512 -1456 2512
WIRE -1328 2512 -1328 2384
WIRE -1328 2512 -1360 2512
WIRE -3456 2576 -3456 2512
WIRE -3360 2576 -3456 2576
WIRE -2832 2576 -2832 2512
WIRE -2464 2576 -2832 2576
WIRE -4480 2624 -4480 2080
WIRE -3728 2624 -4480 2624
WIRE -3648 2624 -3648 2512
WIRE -3648 2624 -3728 2624
WIRE -3088 2624 -3648 2624
WIRE -3024 2624 -3024 2512
WIRE -3024 2624 -3088 2624
WIRE -2144 2624 -3024 2624
WIRE -2016 2624 -2016 2512
WIRE -2016 2624 -2144 2624
WIRE -1552 2624 -1552 2512
WIRE -1552 2624 -2016 2624
WIRE -1360 2656 -1360 2512
WIRE -1088 2656 -1088 1216
WIRE -1088 2656 -1360 2656
WIRE -1824 2672 -1824 2512
WIRE -1136 2672 -1136 1536
WIRE -1136 2672 -1824 2672
WIRE -3552 2720 -3552 2512
WIRE -3552 2720 -3920 2720
WIRE -2928 2720 -2928 2512
WIRE -2928 2720 -3552 2720
WIRE -1920 2720 -1920 2512
WIRE -1920 2720 -2928 2720
WIRE -3648 3136 -3648 2832
WIRE -3648 3136 -3680 3136
WIRE -3456 3136 -3456 2832
WIRE -3456 3136 -3648 3136
WIRE -3424 3136 -3456 3136
WIRE -3008 3136 -3008 2832
WIRE -3008 3136 -3040 3136
WIRE -2816 3136 -2816 2832
WIRE -2816 3136 -3008 3136
WIRE -2784 3136 -2816 3136
WIRE -2016 3136 -2016 2832
WIRE -2016 3136 -2048 3136
WIRE -1824 3136 -1824 2832
WIRE -1824 3136 -2016 3136
WIRE -1792 3136 -1824 3136
WIRE -4624 3152 -5168 3152
WIRE -3680 3264 -3680 3136
WIRE -3648 3264 -3648 3136
WIRE -3648 3264 -3680 3264
WIRE -3552 3264 -3552 2832
WIRE -3552 3264 -3648 3264
WIRE -3456 3264 -3456 3136
WIRE -3456 3264 -3552 3264
WIRE -3424 3264 -3424 3136
WIRE -3424 3264 -3456 3264
WIRE -3040 3264 -3040 3136
WIRE -3008 3264 -3008 3136
WIRE -3008 3264 -3040 3264
WIRE -2912 3264 -2912 2832
WIRE -2912 3264 -3008 3264
WIRE -2816 3264 -2816 3136
WIRE -2816 3264 -2912 3264
WIRE -2784 3264 -2784 3136
WIRE -2784 3264 -2816 3264
WIRE -2048 3264 -2048 3136
WIRE -2016 3264 -2016 3136
WIRE -2016 3264 -2048 3264
WIRE -1920 3264 -1920 2832
WIRE -1920 3264 -2016 3264
WIRE -1824 3264 -1824 3136
WIRE -1824 3264 -1920 3264
WIRE -1792 3264 -1792 3136
WIRE -1792 3264 -1824 3264
WIRE -4864 3296 -4960 3296
WIRE -2816 3296 -2816 3264
WIRE -2464 3296 -2464 2576
WIRE -2464 3296 -2816 3296
WIRE -3728 3328 -3728 2624
WIRE -3648 3328 -3648 3264
WIRE -3648 3328 -3728 3328
WIRE -3088 3328 -3088 2624
WIRE -3008 3328 -3008 3264
WIRE -3008 3328 -3088 3328
WIRE -2144 3328 -2144 2624
WIRE -2016 3328 -2016 3264
WIRE -2016 3328 -2144 3328
WIRE -1824 3344 -1824 3264
WIRE -1120 3344 -1120 1472
WIRE -1120 3344 -1824 3344
WIRE -3920 3360 -3920 2720
WIRE -3920 3360 -4912 3360
WIRE -3552 3360 -3552 3264
WIRE -3552 3360 -3920 3360
WIRE -2912 3360 -2912 3264
WIRE -2912 3360 -3552 3360
WIRE -1920 3360 -1920 3264
WIRE -1920 3360 -2912 3360
WIRE -1456 3360 -1456 2512
WIRE -1456 3360 -1920 3360
WIRE -4960 3408 -4960 3296
WIRE -4864 3408 -4864 3296
WIRE -4864 3408 -4960 3408
WIRE -3456 3440 -3456 3264
WIRE -3360 3440 -3360 2576
WIRE -3360 3440 -3456 3440
WIRE -1152 3440 -1152 1664
WIRE -1152 3440 -3360 3440
WIRE -5168 3504 -5168 3152
WIRE -4624 3504 -4624 3152
WIRE -4624 3504 -5168 3504
WIRE -2464 3504 -2464 3296
WIRE -1072 3504 -1072 1088
WIRE -1072 3504 -2464 3504
WIRE -5504 3632 -5504 -6368
WIRE -4912 3632 -4912 3360
WIRE -4912 3632 -5504 3632
SYMBOL sw 144 -3072 R0
SYMATTR InstName S1
SYMBOL sw 304 -3072 R0
SYMATTR InstName S2
SYMBOL sw 448 -3072 R0
SYMATTR InstName S3
SYMBOL sw 592 -3072 R0
SYMATTR InstName S4
SYMBOL sw 736 -3072 R0
SYMATTR InstName S5
SYMBOL sw 880 -3072 R0
SYMATTR InstName S6
SYMBOL sw 1024 -3072 R0
SYMATTR InstName S7
SYMBOL sw 1168 -3072 R0
SYMATTR InstName S8
SYMBOL sw 1328 -3072 R0
SYMATTR InstName S9
SYMBOL sw 1488 -3072 R0
SYMATTR InstName S10
SYMBOL sw 1648 -3072 R0
SYMATTR InstName S11
SYMBOL sw 1792 -3072 R0
SYMATTR InstName S12
SYMBOL sw 1952 -3072 R0
SYMATTR InstName S13
SYMBOL sw 2096 -3072 R0
SYMATTR InstName S14
SYMBOL sw 2240 -3072 R0
SYMATTR InstName S15
SYMBOL sw 2384 -3072 R0
SYMATTR InstName S16
SYMBOL sw 384 -3680 R180
SYMATTR InstName ON/OFF
SYMBOL LED 128 -3232 R0
SYMATTR InstName D1
SYMBOL LED 288 -3232 R0
SYMATTR InstName D2
SYMBOL LED 432 -3232 R0
SYMATTR InstName D3
SYMBOL LED 576 -3232 R0
SYMATTR InstName D4
SYMBOL LED 720 -3232 R0
SYMATTR InstName D5
SYMBOL LED 864 -3232 R0
SYMATTR InstName D6
SYMBOL LED 1008 -3232 R0
SYMATTR InstName D7
SYMBOL LED 1152 -3232 R0
SYMATTR InstName D8
SYMBOL LED 1312 -3232 R0
SYMATTR InstName D9
SYMBOL LED 1472 -3232 R0
SYMATTR InstName D10
SYMBOL LED 1632 -3232 R0
SYMATTR InstName D11
SYMBOL LED 1776 -3232 R0
SYMATTR InstName D12
SYMBOL LED 1936 -3232 R0
SYMATTR InstName D13
SYMBOL LED 2080 -3232 R0
SYMATTR InstName D14
SYMBOL LED 2224 -3232 R0
SYMATTR InstName D15
SYMBOL LED 2368 -3232 R0
SYMATTR InstName D16
SYMBOL res -992 1632 R0
SYMATTR InstName R1
SYMATTR Value 1K
SYMATTR SpiceLine tol=1 pwr=0.1
SYMBOL res -992 1424 R0
SYMATTR InstName R2
SYMATTR Value 2k
SYMBOL res 5168 1664 R0
SYMATTR InstName R3
SYMATTR Value 1k
SYMBOL res 5168 1552 R0
SYMATTR InstName R4
SYMATTR Value 2k
TEXT 2384 -4504 Left 2 ;Live
TEXT 2008 -4504 Left 2 ;Ground
TEXT 2184 -4504 Left 2 ;Neutral
TEXT 4512 -4024 Left 2 ;Voltage Step Down1
TEXT 4600 -4160 Left 2 ;High
TEXT 4608 -3768 Left 2 ;Low
TEXT 1224 -4512 Left 2 ;3
TEXT 1424 -4512 Left 2 ;4
TEXT 1632 -4512 Left 2 ;5
TEXT 1824 -4512 Left 2 ;6
TEXT 496 -3760 Left 2 ;Switch that powers TOP
TEXT 1064 -5160 Left 2 ;Power Supply
TEXT 1120 -5048 Left 2 ;24 V DC
TEXT -2544 1856 Left 2 ;A5
TEXT -2544 1792 Left 2 ;A4
TEXT -2544 1728 Left 2 ;A3
TEXT -2544 1664 Left 2 ;A2
TEXT -2544 1600 Left 2 ;A1
TEXT -2544 1536 Left 2 ;A0
TEXT -2544 1280 Left 2 ;Vin
TEXT -2544 1216 Left 2 ;GND
TEXT -2544 1152 Left 2 ;GND
TEXT -2536 1088 Left 2 ;5V
TEXT -2536 1024 Left 2 ;3V3
TEXT -2544 960 Left 2 ;RESET
TEXT -2544 896 Left 2 ;IOREF
TEXT -1360 1856 Left 2 ;RX <- 0
TEXT -1352 1792 Left 2 ;TX -> 1
TEXT -1320 1728 Left 2 ;2
TEXT -1320 1656 Left 2 ;~3
TEXT 3648 1856 Left 2 ;A5
TEXT 3648 1792 Left 2 ;A4
TEXT 3648 1728 Left 2 ;A3
TEXT 3648 1664 Left 2 ;A2
TEXT 3648 1600 Left 2 ;A1
TEXT 3648 1536 Left 2 ;A0
TEXT 3648 1280 Left 2 ;Vin
TEXT 3648 1216 Left 2 ;GND
TEXT 3648 1152 Left 2 ;GND
TEXT 3656 1088 Left 2 ;5V
TEXT 3656 1024 Left 2 ;3V3
TEXT 3648 960 Left 2 ;RESET
TEXT 3648 896 Left 2 ;IOREF
TEXT 4832 1856 Left 2 ;RX <- 0
TEXT 4840 1792 Left 2 ;TX -> 1
TEXT 4872 1728 Left 2 ;2
TEXT 4872 1656 Left 2 ;~3
TEXT 48 -3280 Left 2 ;universal ground
TEXT 312 -3280 Left 2 ;+A1
TEXT 464 -3280 Left 2 ;+A2
TEXT 600 -3280 Left 2 ;+A3
TEXT 744 -3280 Left 2 ;+A4
TEXT -1320 1600 Left 2 ;4
TEXT -1328 1536 Left 2 ;~5
TEXT -1328 1472 Left 2 ;~6
TEXT -1312 1408 Left 2 ;7
TEXT -1320 1280 Left 2 ;8
TEXT -1328 1216 Left 2 ;~9
TEXT -1336 1152 Left 2 ;~10
TEXT -1336 1088 Left 2 ;~11
TEXT -1328 1024 Left 2 ;12
TEXT -1328 960 Left 2 ;13
TEXT -1344 904 Left 2 ;GND
TEXT -1336 824 Left 2 ;REF
TEXT -1336 768 Left 2 ;SDA
TEXT -1336 704 Left 2 ;SCL
TEXT 4872 1600 Left 2 ;4
TEXT 4864 1536 Left 2 ;~5
TEXT 4864 1472 Left 2 ;~6
TEXT 4880 1408 Left 2 ;7
TEXT 4872 1280 Left 2 ;8
TEXT 4864 1216 Left 2 ;~9
TEXT 4856 1152 Left 2 ;~10
TEXT 4856 1088 Left 2 ;~11
TEXT 4864 1024 Left 2 ;12
TEXT 4864 960 Left 2 ;13
TEXT 4848 904 Left 2 ;GND
TEXT 4856 824 Left 2 ;REF
TEXT 4856 768 Left 2 ;SDA
TEXT 4856 704 Left 2 ;SCL
TEXT 48 -3640 VLeft 2 ;PMOD L2
TEXT 2504 -3720 VRight 2 ;PMOD R2
TEXT -2256 -6840 Left 2 ;Voltage Step Down2
TEXT -2168 -6976 Left 2 ;High
TEXT -2176 -6600 Left 2 ;Low
TEXT 816 -4512 Left 2 ;1
TEXT 1024 -4512 Left 2 ;2
TEXT 1008 -4624 Left 2 ;1-3 +V
TEXT 1608 -4624 Left 2 ;4-6 -V
TEXT 936 -4432 Left 2 ;PWR DC-to-DC 1
TEXT 1136 -4432 Left 2 ;PWR DC-to-DC 2
TEXT 1544 -4432 Left 2 ;GND DC-to-DC 1
TEXT 1752 -4432 Left 2 ;GND DC-to-DC 2
TEXT 2128 -4616 Left 2 ;7 GND, 8, Neutral, 9 Live
TEXT -3008 2232 Left 2 ;brown
TEXT -2920 2232 Left 2 ;yellow
TEXT -2000 2232 Left 2 ;brown
TEXT -1912 2232 Left 2 ;yellow
TEXT -2992 2984 Left 2 ;brown
TEXT -2904 2984 Left 2 ;yellow
TEXT -2000 2984 Left 2 ;brown
TEXT -1912 2984 Left 2 ;yellow
TEXT -3632 2232 Left 2 ;brown
TEXT -3544 2232 Left 2 ;yellow
TEXT -3720 2984 Left 2 ;red->
TEXT -3632 2984 Left 2 ;brown
TEXT -3544 2984 Left 2 ;yellow
TEXT -3592 2792 Left 2 ;FS90R
TEXT -4552 1848 Left 2 ;power node
TEXT -4984 3112 Left 2 ;GND node
TEXT -3728 2232 Left 2 ;red->
TEXT -3096 2232 Left 2 ;red->
TEXT -2096 2232 Left 2 ;red->
TEXT -2088 2984 Left 2 ;red->
TEXT -3080 2984 Left 2 ;red->
TEXT 48 -3144 VLeft 2 ;PMOD L1
TEXT 2504 -3224 VRight 2 ;PMOD R1
TEXT -56 -3896 Left 2 ;Tx
TEXT -168 -3896 Left 2 ;Rx
TEXT 6456 -648 Left 2 ;power node
TEXT 7816 -648 Left 2 ;GND node
TEXT 5608 984 Left 2 ;yellow
TEXT 5424 984 Left 2 ;red->
TEXT 5608 1608 Left 2 ;yellow
TEXT 5424 1608 Left 2 ;red->
TEXT 5520 408 Left 2 ;black
TEXT 5608 408 Left 2 ;yellow
TEXT 5424 408 Left 2 ;red->
TEXT 6064 392 Left 2 ;red->
TEXT 6200 392 Left 2 ;black
TEXT 6064 968 Left 2 ;red->
TEXT 6200 968 Left 2 ;black
TEXT 6064 1592 Left 2 ;red->
TEXT 6200 1592 Left 2 ;black
TEXT 6968 936 Left 2 ;yellow
TEXT 6784 936 Left 2 ;red->
TEXT 7424 920 Left 2 ;red->
TEXT 7560 920 Left 2 ;black
TEXT 6880 936 Left 2 ;black
TEXT 5520 1608 Left 2 ;black
TEXT 5520 984 Left 2 ;black
TEXT -1536 2232 Left 2 ;brown
TEXT -1448 2232 Left 2 ;yellow
TEXT -1632 2232 Left 2 ;red->
TEXT -2200 -6728 Left 2 ;6A Buck
TEXT 4584 -3896 Left 2 ;Default
TEXT -2944 2784 Left 2 ;FS90R
TEXT -3584 2032 Left 2 ;FS90R
TEXT -2952 2032 Left 2 ;FS90R
TEXT -1952 2048 Left 2 ;FS90R
TEXT -1480 2032 Left 2 ;FS90R
TEXT -1960 2784 Left 2 ;FS90R

The netlist it stands for:
* FDR Schematic.asc
S1 N037 N021 N015 N015 SW
S2 N038 N022 N015 N015 SW
S3 N039 N023 N015 N015 SW
S4 N040 N024 N015 N015 SW
S5 N041 N025 N015 N015 SW
S6 N042 N026 N015 N015 SW
S7 N043 N027 N015 N015 SW
S8 N044 N028 N015 N015 SW
S9 N045 N029 N015 N015 SW
S10 N046 N030 N015 N015 SW
S11 N047 N031 N015 N015 SW
S12 N048 N032 N015 N015 SW
S13 N049 N033 N015 N015 SW
S14 N050 N034 N015 N015 SW
S15 N051 N035 N015 N015 SW
S16 N052 N036 N015 N015 SW
S§ON/OFF N001 N015 N001 N001 SW
D1 N021 N037 D
D2 N022 N038 D
D3 N023 N039 D
D4 N024 N040 D
D5 N025 N041 D
D6 N026 N042 D
D7 N027 N043 D
D8 N028 N044 D
D9 N029 N045 D
D10 N030 N046 D
D11 N031 N047 D
D12 N032 N048 D
D13 N033 N049 D
D14 N034 N050 D
D15 N035 N051 D
D16 N036 N052 D
R1 N061 N001 1K tol=1 pwr=0.1
R2 N016 N061 2k
R3 N062 N001 1k
R4 N020 N062 2k
.model D D
.lib standard.dio
* Live
* Ground
* Neutral
* Voltage Step Down1
* High
* Low
* 3
* 4
* 5
* 6
* Switch that powers TOP
* Power Supply
* 24 V DC
* A5
* A4
* A3
* A2
* A1
* A0
* Vin
* GND
* GND
* 5V
* 3V3
* RESET
* IOREF
* RX <- 0
* TX -> 1
* 2
* ~3
* A5
* A4
* A3
* A2
* A1
* A0
* Vin
* GND
* GND
* 5V
* 3V3
* RESET
* IOREF
* RX <- 0
* TX -> 1
* 2
* ~3
* universal ground
* +A1
* +A2
* +A3
* +A4
* 4
* ~5
* ~6
* 7
* 8
* ~9
* ~10
* ~11
* 12
* 13
* GND
* REF
* SDA
* SCL
* 4
* ~5
* ~6
* 7
* 8
* ~9
* ~10
* ~11
* 12
* 13
* GND
* REF
* SDA
* SCL
* PMOD L2
* PMOD R2
* Voltage Step Down2
* High
* Low
* 1
* 2
* 1-3 +V
* 4-6 -V
* PWR DC-to-DC 1
* PWR DC-to-DC 2
* GND DC-to-DC 1
* GND DC-to-DC 2
* 7 GND, 8, Neutral, 9 Live
* brown
* yellow
* brown
* yellow
* brown
* yellow
* brown
* yellow
* brown
* yellow
* red->
* brown
* yellow
* FS90R
* power node
* GND node
* red->
* red->
* red->
* red->
* red->
* PMOD L1
* PMOD R1
* Tx
* Rx
* power node
* GND node
* yellow
* red->
* yellow
* red->
* black
* yellow
* red->
* red->
* black
* red->
* black
* red->
* black
* yellow
* red->
* red->
* black
* black
* black
* black
* brown
* yellow
* red->
* 6A Buck
* Default
* FS90R
* FS90R
* FS90R
* FS90R
* FS90R
* FS90R
.backanno
.end